# Altium project Motor_v2.PrjPcb
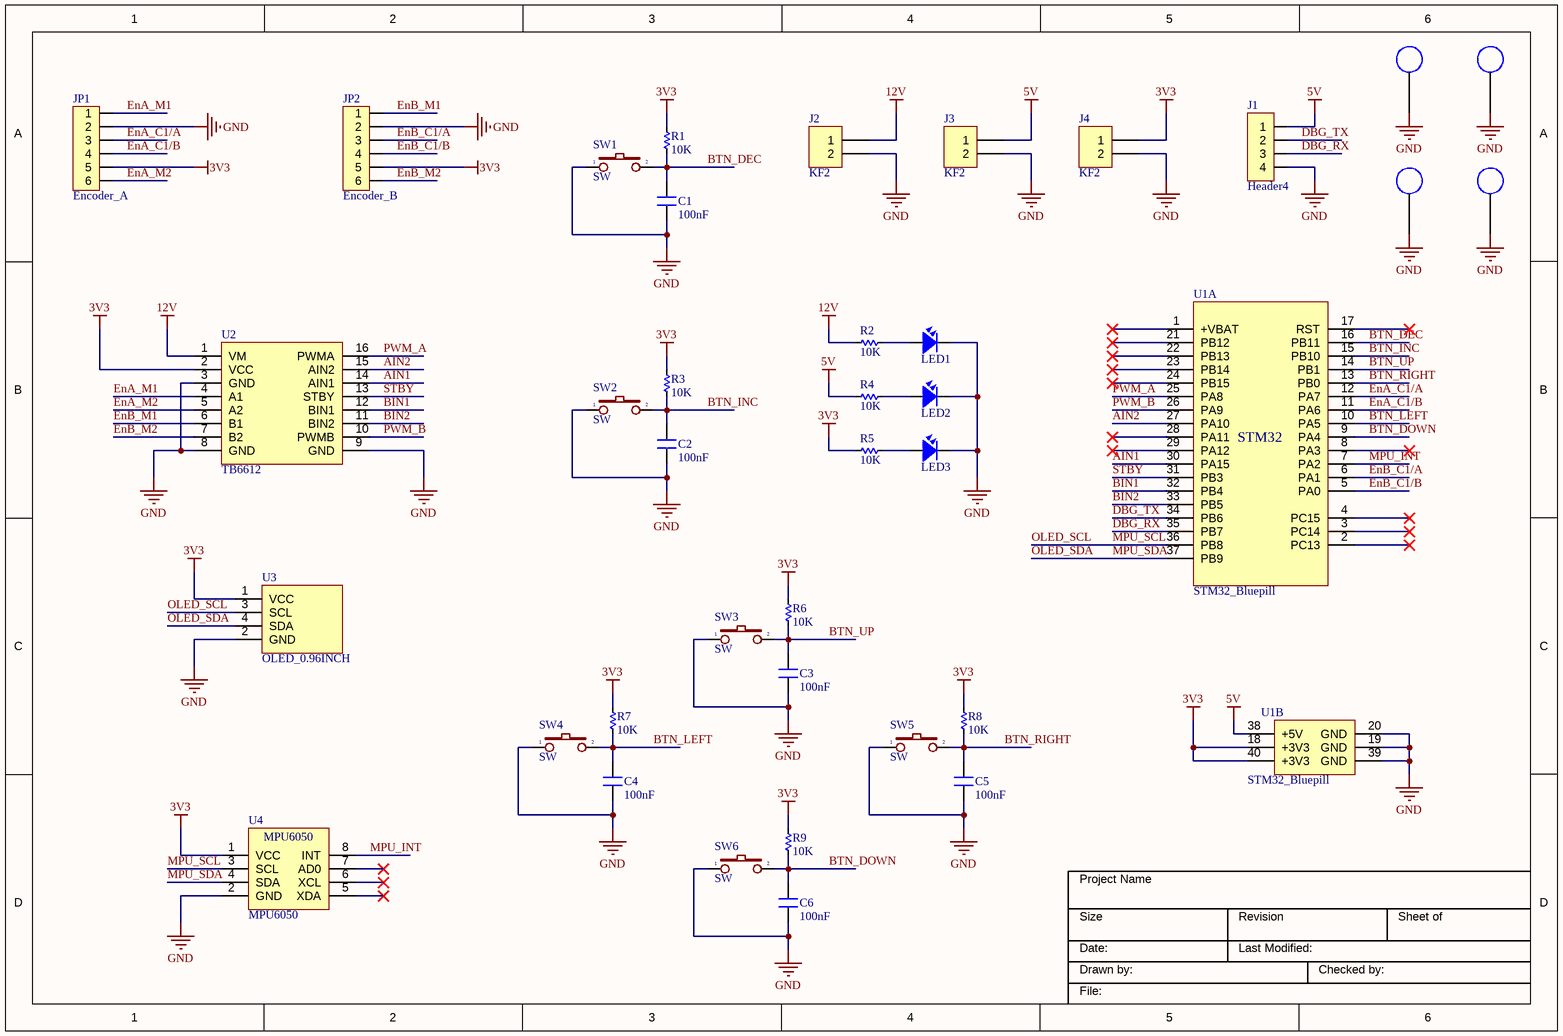
[diagram p0: Main_board.SchDoc]
1 sheet, 38 parts. Net scope: global (net labels, ports and power ports of the same name join across sheets).
Board file: main_b.PcbDoc

## Sheet Main_board.SchDoc
size 292 x 193 mm; SheetNumber: 1; SheetTotal: 1

### Parts
C1  100nF  [CN1]
C2  100nF  [CN1]
C3  100nF  [CN1]
C4  100nF  [CN1]
C5  100nF  [CN1]
C6  100nF  [CN1]
H1  M3  [M3]  (value not drawn)
H2  M3  [M3]  (value not drawn)
H3  M3  [M3]  (value not drawn)
H4  M3  [M3]  (value not drawn)
J1  Header4  [Header4]
J2  KF2  [KF2-5.08]
J3  KF2  [KF2-5.08]
J4  KF2  [KF2-5.08]
JP1  Encoder_A  [Header6]
JP2  Encoder_B  [Header6]
LED1  LED  [LED-3MM-GREEN]  (value not drawn)
LED2  LED  [LED-3MM-GREEN]  (value not drawn)
LED3  LED  [LED-3MM-BLUE]  (value not drawn)
R1  10K  [RES-1/4W-SMALL]
R2  10K  [RES-1/4W-SMALL]
R3  10K  [RES-1/4W-SMALL]
R4  10K  [RES-1/4W-SMALL]
R5  10K  [RES-1/4W-SMALL]
R6  10K  [RES-1/4W-SMALL]
R7  10K  [RES-1/4W-SMALL]
R8  10K  [RES-1/4W-SMALL]
R9  10K  [RES-1/4W-SMALL]
SW1  SW  [SW1-DIP-12x12x8-Red]
SW2  SW  [SW1-DIP-12x12x8-Red]
SW3  SW  [SW1-DIP-12x12x8-Red]
SW4  SW  [SW1-DIP-12x12x8-Red]
SW5  SW  [SW1-DIP-12x12x8-Red]
SW6  SW  [SW1-DIP-12x12x8-Red]
U1  STM32_Bluepill  [STM32F103_BluePill]  (parts A,B of 2)
U2  TB6612  [TB6612]
U3  OLED_0.96INCH  [OLED_0.96-inch]
U4  MPU6050  [MPU6050]

### Nets
3V3: J4.1 JP1.5 JP2.5 R1.1 R3.1 R5.1 R6.1 R7.1 R8.1 R9.1 U1.18(+3V3) U1.40(+3V3) U2.2(VCC) U3.1(VCC) U4.1(VCC)
5V: J1.1 J3.1 R4.1 U1.38(+5V)
12V: J2.1 R2.1 U2.1(VM)
GND: C1.1 C2.1 C3.1 C4.1 C5.1 C6.1 H1.1 H2.1 H3.1 H4.1 J1.4 J2.2 J3.2 J4.2 JP1.2 JP2.2 LED1.2 LED2.2 LED3.2 SW1.1 SW2.1 SW3.1 SW4.1 SW5.1 SW6.1 U1.19(GND) U1.20(GND) U1.39(GND) U2.3(GND) U2.8(GND) U2.9(GND) U3.2(GND) U4.2(GND)
AIN1: U1.30(PA15) U2.14(AIN1)
AIN2: U1.27(PA10) U2.15(AIN2)
BIN1: U1.32(PB4) U2.12(BIN1)
BIN2: U1.33(PB5) U2.11(BIN2)
BTN_DEC: C1.2 R1.2 SW1.2 U1.16(PB11)
BTN_DOWN: C6.2 R9.2 SW6.2 U1.9(PA4)
BTN_INC: C2.2 R3.2 SW2.2 U1.15(PB10)
BTN_LEFT: C4.2 R7.2 SW4.2 U1.10(PA5)
BTN_RIGHT: C5.2 R8.2 SW5.2 U1.13(PB0)
BTN_UP: C3.2 R6.2 SW3.2 U1.14(PB1)
DBG_RX: J1.3 U1.35(PB7)
DBG_TX: J1.2 U1.34(PB6)
EnA_C1/A: JP1.3 U1.12(PA7)
EnA_C1/B: JP1.4 U1.11(PA6)
EnA_M1: JP1.1 U2.4(A1)
EnA_M2: JP1.6 U2.5(A2)
EnB_C1/A: JP2.3 U1.6(PA1)
EnB_C1/B: JP2.4 U1.5(PA0)
EnB_M1: JP2.1 U2.6(B1)
EnB_M2: JP2.6 U2.7(B2)
MPU_INT: U1.7(PA2) U4.8(INT)
MPU_SCL: U1.36(PB8) U3.3(SCL) U4.3(SCL)  [also labelled OLED_SCL]
MPU_SDA: U1.37(PB9) U3.4(SDA) U4.4(SDA)  [also labelled OLED_SDA]
PWM_A: U1.25(PA8) U2.16(PWMA)
PWM_B: U1.26(PA9) U2.10(PWMB)
STBY: U1.31(PB3) U2.13(STBY)
NetLED1_1: LED1.1 R2.2
NetLED2_1: LED2.1 R4.2
NetLED3_1: LED3.1 R5.2

Not connected (* = marked no-connect by the designer): U1 1(+VBAT)* 2(PC13)* 3(PC14)* 4(PC15)* 8(PA3)* 17(RST)* 21(PB12)* 22(PB13)* 23(PB14)* 24(PB15)* 28(PA11)* 29(PA12)*; U4 5(XDA)* 6(XCL)* 7(AD0)*

### Notes on the sheet
- Project Name
- Size
- Revision
- Sheet of
- Date:
- Drawn by:
- Last Modified:
- Checked by:
- File:
- (in symbol STM32_Bluepill, part A) STM32

### Library data of the parts
C1-C6 = Cap: Value: 33pF
J1 = Header4: Header IDC, 4 x 1 Pin Vertical 2.54mm Pitch (Non-Boxed, Male); Manufacturer: W¨¹rth Elektronik eiSos GmbH; partNo: 613002143121; ComponentLink1 Description: Manufacturer; ComponentLink2 Description: Datasheet; NoPins: 02; Created Date: 29 March 2013; ComponentLink1URL: http://www.we-online.com; ComponentLink2URL: http://katalog.we-online.de/em/datasheet/6130xx143121.pdf; Created by: Karrer Zheng
J2-J4 = KF2: Manufacturer: Würth Elektronik eiSos GmbH; partNo: 691103110002; ComponentLink1 Description: Manufacturer; ComponentLink2 Description: Datasheet; NoPins: 2; Created Date: 29 October 2013; ComponentLink1URL: http://www.we-online.com; ComponentLink2URL: http://katalog.we-online.de/em/datasheet/6911031100xx.pdf; Created by: Karrer Zheng
JP1 JP2 = Header6: Header IDC, 6 x 1 Pin Vertical 2.54mm Pitch (Non-Boxed, Male); Manufacturer: W¨¹rth Elektronik eiSos GmbH; partNo: 613002143121; ComponentLink1 Description: Manufacturer; ComponentLink2 Description: Datasheet; NoPins: 02; Created Date: 29 March 2013; ComponentLink1URL: http://www.we-online.com; ComponentLink2URL: http://katalog.we-online.de/em/datasheet/6130xx143121.pdf; Created by: Karrer Zheng
LED1-LED3 = LED: LED Single colour Green and Red; Value: LED 3 ly Single Colour
R1-R9 = Res: Manufacturer: Generic Components; Class: Passive; SubClass: R; Published: 08/06/2000; Publisher: Altium Hobart Technology Centre
SW1-SW6 = SW2: Switch button 2 pin; Value: SW chip 2 pin
U4 = MPU6050: Manufacturer: W¨¹rth Elektronik eiSos GmbH; partNo: 613004143121; ComponentLink1 Description: Manufacturer; ComponentLink2 Description: Datasheet; NoPins: 04; Created Date: 29 March 2013; ComponentLink1URL: http://www.we-online.com; ComponentLink2URL: http://katalog.we-online.de/em/datasheet/6130xx143121.pdf; Created by: Karrer Zheng